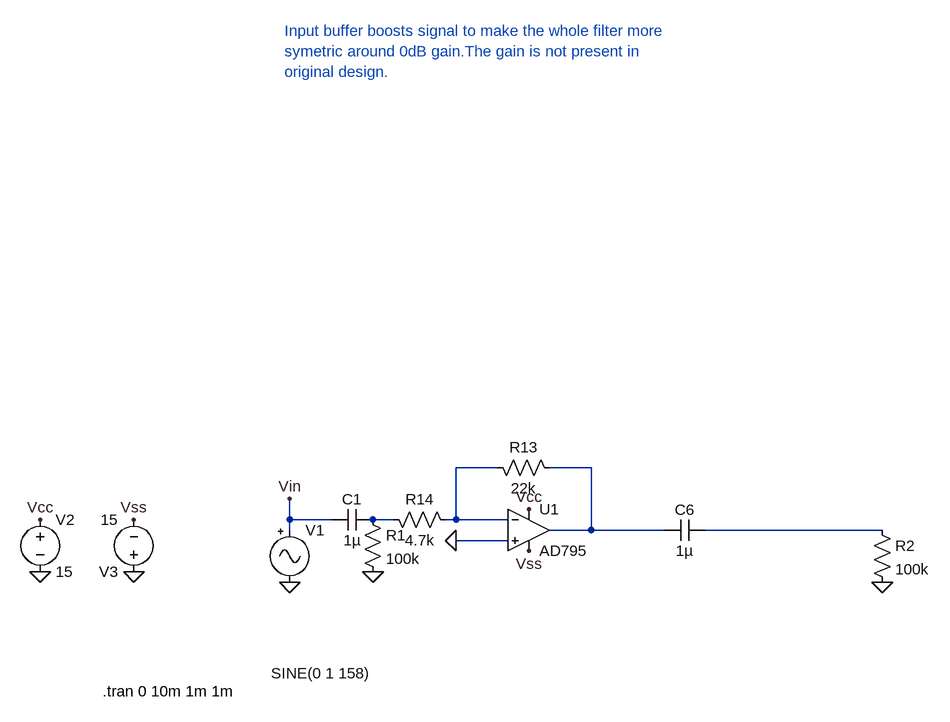
[diagram p0: schematic InvertingOpAmp.asc]
InvertingOpAmp.asc, the LTspice schematic file:
Version 4
SHEET 1 3012 1396
WIRE -48 384 -112 384
WIRE 96 384 32 384
WIRE -368 464 -368 432
WIRE -304 464 -368 464
WIRE -208 464 -240 464
WIRE -112 464 -112 384
WIRE -112 464 -128 464
WIRE -32 464 -112 464
WIRE -368 480 -368 464
WIRE 96 480 96 384
WIRE 96 480 32 480
WIRE 208 480 96 480
WIRE 544 480 272 480
WIRE -32 496 -112 496
FLAG -368 560 0
FLAG 0 448 Vcc
FLAG 0 512 Vss
FLAG -240 544 0
FLAG -368 432 Vin
FLAG 544 560 0
FLAG -752 544 0
FLAG -608 544 0
FLAG -608 464 Vss
FLAG -752 464 Vcc
FLAG -112 496 0
SYMBOL Misc\\signal -368 464 R0
WINDOW 123 -29 213 Left 2
WINDOW 39 0 0 Left 0
WINDOW 3 -29 236 Left 2
SYMATTR Value SINE(0 1 158)
SYMATTR InstName V1
SYMBOL cap -240 448 R90
WINDOW 0 0 32 VBottom 2
WINDOW 3 32 32 VTop 2
SYMATTR InstName C1
SYMATTR Value 1µ
SYMBOL res -256 448 R0
SYMATTR InstName R1
SYMATTR Value 100k
SYMBOL res 48 400 M270
WINDOW 0 32 56 VTop 2
WINDOW 3 0 56 VBottom 2
SYMATTR InstName R13
SYMATTR Value 22k
SYMBOL res -112 480 M270
WINDOW 0 32 56 VTop 2
WINDOW 3 0 56 VBottom 2
SYMATTR InstName R14
SYMATTR Value 4.7k
SYMBOL cap 272 464 R90
WINDOW 0 0 32 VBottom 2
WINDOW 3 32 32 VTop 2
SYMATTR InstName C6
SYMATTR Value 1µ
SYMBOL res 528 464 R0
SYMATTR InstName R2
SYMATTR Value 100k
SYMBOL voltage -752 448 R0
WINDOW 123 0 0 Left 0
WINDOW 39 0 0 Left 0
SYMATTR InstName V2
SYMATTR Value 15
SYMBOL voltage -608 560 R180
WINDOW 123 0 0 Left 0
WINDOW 39 0 0 Left 0
SYMATTR InstName V3
SYMATTR Value 15
SYMBOL OpAmps\\AD795 0 416 R0
SYMATTR InstName U1
TEXT -376 -288 Left 2 ;Input buffer boosts signal to make the whole filter more \nsymetric around 0dB gain.The gain is not present in\noriginal design.
TEXT -656 728 Left 2 !.tran 0 10m 1m 1m

The netlist it stands for:
* InvertingOpAmp.asc
V1 Vin 0 SINE(0 1 158)
C1 N003 Vin 1µ
R1 N003 0 100k
R13 N002 N001 22k
R14 N001 N003 4.7k
C6 N004 N002 1µ
R2 N004 0 100k
V2 Vcc 0 15
V3 0 Vss 15
XU1 0 N001 Vcc Vss N002 AD795  ; pins In+ In- V+ V- OUT
* Input buffer boosts signal to make the whole filter more
* symetric around 0dB gain.The gain is not present in
* original design.
.tran 0 10m 1m 1m
.lib ADI1.lib
.backanno
.end